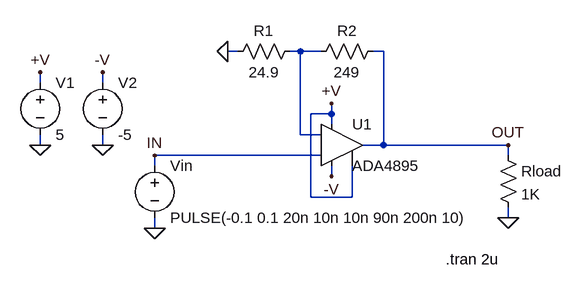
[diagram p0: schematic ADA4895.asc]
ADA4895.asc, the LTspice schematic file:
Version 4
SHEET 1 1240 700
WIRE 416 -1248 400 -1248
WIRE 512 -1248 496 -1248
WIRE 544 -1248 512 -1248
WIRE 640 -1248 624 -1248
WIRE 112 -1200 112 -1216
WIRE 208 -1200 208 -1216
WIRE 560 -1152 560 -1168
WIRE 560 -1152 528 -1152
WIRE 560 -1136 560 -1152
WIRE 512 -1120 512 -1248
WIRE 544 -1120 512 -1120
WIRE 112 -1104 112 -1120
WIRE 208 -1104 208 -1120
WIRE 640 -1104 640 -1248
WIRE 640 -1104 608 -1104
WIRE 832 -1104 640 -1104
WIRE 544 -1088 288 -1088
WIRE 832 -1088 832 -1104
WIRE 288 -1072 288 -1088
WIRE 560 -1056 560 -1072
WIRE 528 -1024 528 -1152
WIRE 592 -1024 592 -1072
WIRE 592 -1024 528 -1024
WIRE 832 -992 832 -1008
WIRE 288 -976 288 -992
FLAG 112 -1216 +V
FLAG 288 -976 0
FLAG 832 -1104 OUT
FLAG 288 -1088 IN
FLAG 560 -1168 +V
FLAG 208 -1216 -V
FLAG 560 -1056 -V
FLAG 400 -1248 0
FLAG 832 -992 0
FLAG 208 -1104 0
FLAG 112 -1104 0
SYMBOL voltage 112 -1216 R0
WINDOW 123 0 0 Left 2
WINDOW 39 0 0 Left 2
SYMATTR InstName V1
SYMATTR Value 5
SYMBOL voltage 288 -1088 R0
WINDOW 123 24 146 Left 2
WINDOW 39 24 125 Left 2
SYMATTR InstName Vin
SYMATTR Value PULSE(-0.1 0.1 20n 10n 10n 90n 200n 10)
SYMBOL res 512 -1264 R90
WINDOW 0 0 56 VBottom 2
WINDOW 3 32 56 VTop 2
SYMATTR InstName R1
SYMATTR Value 24.9
SYMBOL res 640 -1264 R90
WINDOW 0 0 56 VBottom 2
WINDOW 3 32 56 VTop 2
SYMATTR InstName R2
SYMATTR Value 249
SYMBOL voltage 208 -1216 R0
WINDOW 123 24 146 Left 2
WINDOW 39 24 125 Left 2
SYMATTR InstName V2
SYMATTR Value -5
SYMBOL res 816 -1104 R0
SYMATTR InstName Rload
SYMATTR Value 1K
SYMBOL Opamps\\ADA4895 576 -1104 R0
SYMATTR InstName U1
TEXT 736 -928 Left 2 !.tran 2u

The netlist it stands for:
* ADA4895.asc
V1 +V 0 5
Vin IN 0 PULSE(-0.1 0.1 20n 10n 10n 90n 200n 10)
R1 N001 0 24.9
R2 OUT N001 249
V2 -V 0 -5
Rload OUT 0 1K
XU1 IN N001 +V -V OUT +V ADA4895
.tran 2u
.lib ADA4895.lib
.backanno
.end